# Altium schematic sheet AT89S52单片机入门与提高.SchDoc
size A3
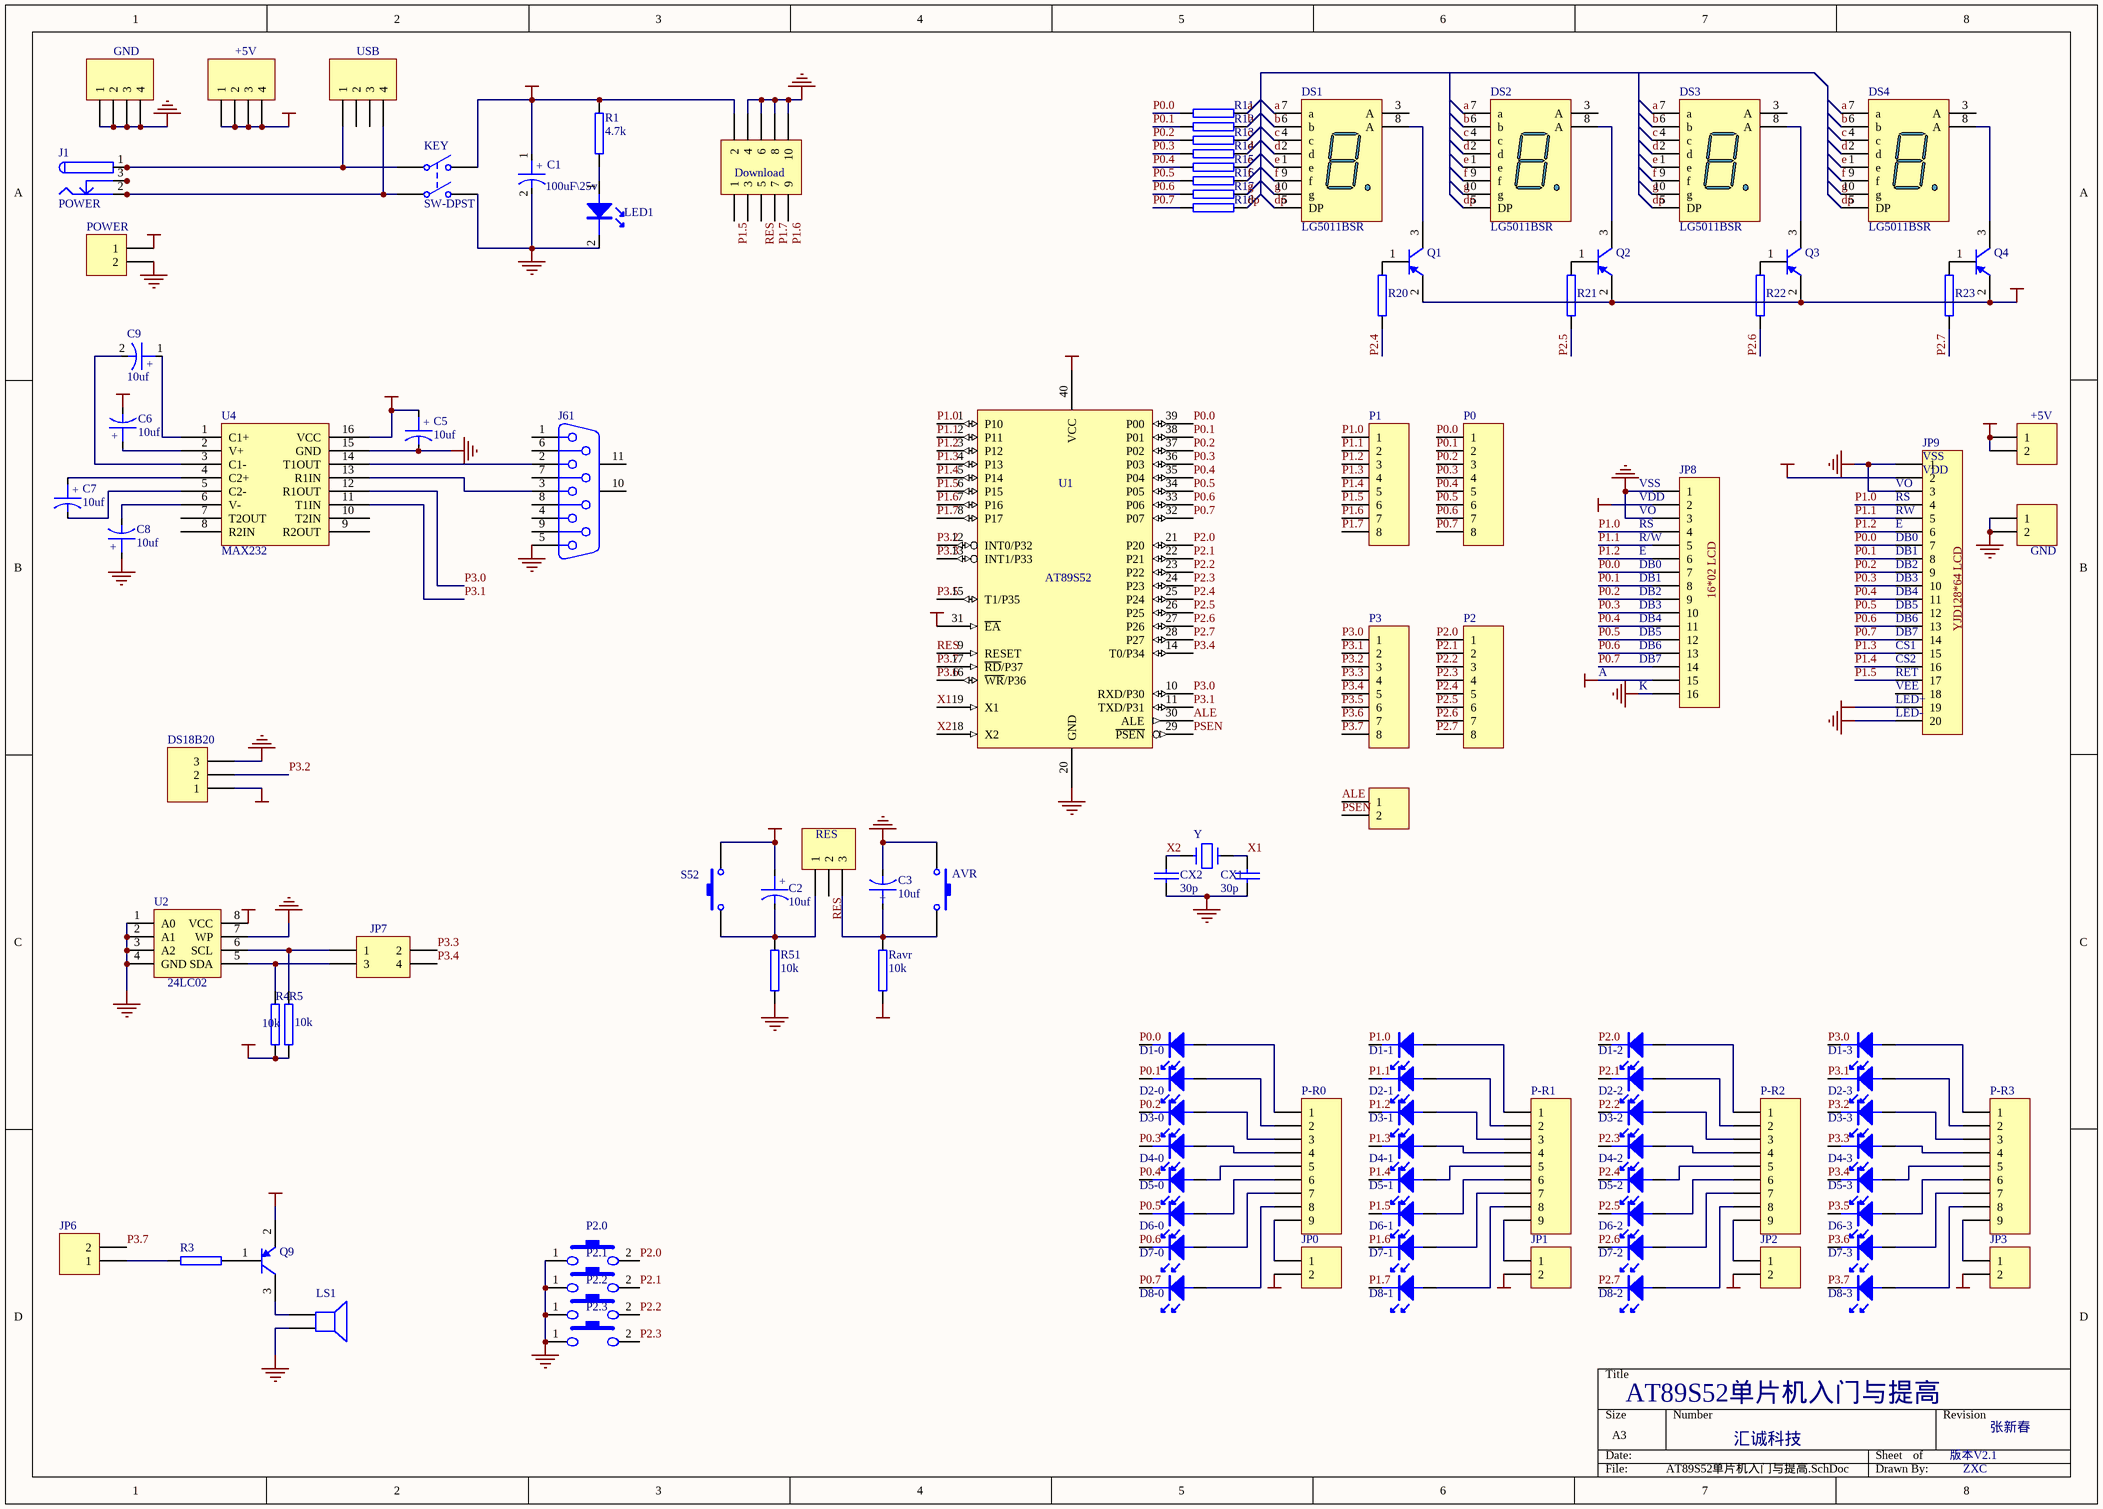
[diagram p0: AT89S52单片机入门与提高.SchDoc]

## Parts
+5V  (no value)  [HDR1X4]
+5V-1  +5V  [HDR1X2]
?  Download  [HDR-2x5]
AVR  (no value)  [an-6*6]
C1  100uF\25v  [C-DJ-6]
C2  10uf  [C-DJ-4]
C3  10uf  [C-DJ-4]
C5  10uf  [C-DJ-4]
C6  10uf  [C-DJ-4]
C7  10uf  [C-DJ-4]
C8  10uf  [C-DJ-4]
C9  10uf  [C-DJ-4]
CX1  30p  [HDR1X2]
CX2  30p  [HDR1X2]
D1-0  LED  [R2012-0805]  (value not drawn)
D1-1  LED  [R2012-0805]  (value not drawn)
D1-2  LED  [R2012-0805]  (value not drawn)
D1-3  LED  [R2012-0805]  (value not drawn)
D2-0  LED  [R2012-0805]  (value not drawn)
D2-1  LED  [R2012-0805]  (value not drawn)
D2-2  LED  [R2012-0805]  (value not drawn)
D2-3  LED  [R2012-0805]  (value not drawn)
D3-0  LED  [R2012-0805]  (value not drawn)
D3-1  LED  [R2012-0805]  (value not drawn)
D3-2  LED  [R2012-0805]  (value not drawn)
D3-3  LED  [R2012-0805]  (value not drawn)
D4-0  LED  [R2012-0805]  (value not drawn)
D4-1  LED  [R2012-0805]  (value not drawn)
D4-2  LED  [R2012-0805]  (value not drawn)
D4-3  LED  [R2012-0805]  (value not drawn)
D5-0  LED  [R2012-0805]  (value not drawn)
D5-1  LED  [R2012-0805]  (value not drawn)
D5-2  LED  [R2012-0805]  (value not drawn)
D5-3  LED  [R2012-0805]  (value not drawn)
D6-0  LED  [R2012-0805]  (value not drawn)
D6-1  LED  [R2012-0805]  (value not drawn)
D6-2  LED  [R2012-0805]  (value not drawn)
D6-3  LED  [R2012-0805]  (value not drawn)
D7-0  LED  [R2012-0805]  (value not drawn)
D7-1  LED  [R2012-0805]  (value not drawn)
D7-2  LED  [R2012-0805]  (value not drawn)
D7-3  LED  [R2012-0805]  (value not drawn)
D8-0  LED  [R2012-0805]  (value not drawn)
D8-1  LED  [R2012-0805]  (value not drawn)
D8-2  LED  [R2012-0805]  (value not drawn)
D8-3  LED  [R2012-0805]  (value not drawn)
DS1  LG5011BSR  [LED-BSR]
DS2  LG5011BSR  [LED-BSR]
DS3  LG5011BSR  [LED-BSR]
DS4  LG5011BSR  [LED-BSR]
DS18B20  (no value)  [HDR1X3]
GND  (no value)  [HDR1X4]
GND-1  GND  [HDR1X2]
J1  POWER  [KLD-dy]
J61  D Connector 9  [DSUB1.385-2H9]  (value not drawn)
JP0  (no value)  [HDR1X2]
JP1  (no value)  [HDR1X2]
JP2  (no value)  [HDR1X2]
JP3  (no value)  [HDR1X2]
JP5  (no value)  [HDR1X2]
JP6  (no value)  [HDR1X2]
JP7  (no value)  [HDR2X2]
JP8  Header 16  [HDR1X16]  (value not drawn)
JP9  (no value)  [HDR1X20]
KEY  SW-DPST  [DPDT-6]
LED1  LED  [LED]  (value not drawn)
LS1  (no value)  [LS1PF]
P0  (no value)  [HDR1X8]
P1  (no value)  [HDR1X8]
P2  (no value)  [HDR1X8]
P2.0  key1  [an-6*6]  (value not drawn)
P2.1  key2  [an-6*6]  (value not drawn)
P2.2  key3  [an-6*6]  (value not drawn)
P2.3  key4  [an-6*6]  (value not drawn)
P3  (no value)  [HDR1X8]
P-R0  (no value)  [HDR1X9]
P-R1  (no value)  [HDR1X9]
P-R2  (no value)  [HDR1X9]
P-R3  (no value)  [HDR1X9]
POWER  (no value)  [JK128]
Q1  2N3906  [SO-G3]  (value not drawn)
Q2  2N3906  [SO-G3]  (value not drawn)
Q3  2N3906  [SO-G3]  (value not drawn)
Q4  2N3906  [SO-G3]  (value not drawn)
Q9  2N3906  [SO-G3]  (value not drawn)
R1  4.7k  [R2012-0805]
R3  (no value)  [R2012-0805]
R4  10k  [R2012-0805]
R5  10k  [R2012-0805]
R11  470  [R2012-0805]  (value not drawn)
R12  470  [R2012-0805]  (value not drawn)
R13  470  [R2012-0805]  (value not drawn)
R14  470  [R2012-0805]  (value not drawn)
R15  470  [R2012-0805]  (value not drawn)
R16  470  [R2012-0805]  (value not drawn)
R17  470  [R2012-0805]  (value not drawn)
R18  470  [R2012-0805]  (value not drawn)
R20  470  [R2012-0805]  (value not drawn)
R21  470  [R2012-0805]  (value not drawn)
R22  470  [R2012-0805]  (value not drawn)
R23  470  [R2012-0805]  (value not drawn)
R51  10k  [R2012-0805]
Ravr  10k  [R2012-0805]
RES  (no value)  [HDR1X3]
S52  (no value)  [an-6*6]
U1  AT89S52  [AT89S52Pid]
U2  24LC02  [DIP8]
U4  MAX232  [DIP16]
USB  (no value)  [USB-5V]
Y  Y  [11.0592M]

## Nets
GND: ?.4 ?.6 ?.8 ?.10 AVR.2 C1.2 C3.2 C5.2 C8.1 CX1.2 CX2.2 DS18B20.3 GND.1 GND.2 GND.3 GND.4 GND-1.1 GND-1.2 J61.5 JP8.1 JP8.3 JP8.16 JP9.1 JP9.3 JP9.20 KEY.4(NO2) LED1.2(K) LS1.2 P2.0.1 P2.1.1 P2.2.1 P2.3.1 POWER.2 R51.2 U1.20(GND) U2.1(A0) U2.2(A1) U2.3(A2) U2.4(GND) U2.7(WP) U4.15(GND)
VCC: +5V.1 +5V.2 +5V.3 +5V.4 +5V-1.1 +5V-1.2 ?.2 C1.1 C2.1 C5.1 C6.2 DS18B20.1 JP0.2 JP1.2 JP2.2 JP3.2 JP8.2 JP8.15 JP9.2 JP9.19 KEY.2(NO1) POWER.1 Q1.2(E) Q2.2(E) Q3.2(E) Q4.2(E) Q9.2(E) R1.1 R4.2 R5.2 Ravr.2 S52.2 U1.31(~{EA}) U1.40(VCC) U2.8(VCC) U4.16(VCC)
a: DS1.7(a) DS2.7(a) DS3.7(a) DS4.7(a) R11.2
ALE: JP5.1 U1.30(ALE)
b: DS1.6(b) DS2.6(b) DS3.6(b) DS4.6(b) R12.2
c: DS1.4(c) DS2.4(c) DS3.4(c) DS4.4(c) R13.2
d: DS1.2(d) DS2.2(d) DS3.2(d) DS4.2(d) R14.2
dp: DS1.5(DP) DS2.5(DP) DS3.5(DP) DS4.5(DP) R18.2
e: DS1.1(e) DS2.1(e) DS3.1(e) DS4.1(e) R15.2
f: DS1.9(f) DS2.9(f) DS3.9(f) DS4.9(f) R16.2
g: DS1.10(g) DS2.10(g) DS3.10(g) DS4.10(g) R17.2
P0.0: D1-0.2(K) JP8.7 JP9.7 P0.1 R11.1 U1.39(P00)
P0.1: D2-0.2(K) JP8.8 JP9.8 P0.2 R12.1 U1.38(P01)
P0.2: D3-0.2(K) JP8.9 JP9.9 P0.3 R13.1 U1.37(P02)
P0.3: D4-0.2(K) JP8.10 JP9.10 P0.4 R14.1 U1.36(P03)
P0.4: D5-0.2(K) JP8.11 JP9.11 P0.5 R15.1 U1.35(P04)
P0.5: D6-0.2(K) JP8.12 JP9.12 P0.6 R16.1 U1.34(P05)
P0.6: D7-0.2(K) JP8.13 JP9.13 P0.7 R17.1 U1.33(P06)
P0.7: D8-0.2(K) JP8.14 JP9.14 P0.8 R18.1 U1.32(P07)
P1.0: D1-1.2(K) JP8.4 JP9.4 P1.1 U1.1(P10)
P1.1: D2-1.2(K) JP8.5 JP9.5 P1.2 U1.2(P11)
P1.2: D3-1.2(K) JP8.6 JP9.6 P1.3 U1.3(P12)
P1.3: D4-1.2(K) JP9.15 P1.4 U1.4(P13)
P1.4: D5-1.2(K) JP9.16 P1.5 U1.5(P14)
P1.5: ?.1 D6-1.2(K) JP9.17 P1.6 U1.6(P15)
P1.6: ?.9 D7-1.2(K) P1.7 U1.7(P16)
P1.7: ?.7 D8-1.2(K) P1.8 U1.8(P17)
P2.0: D1-2.2(K) P2.1 P2.0.2 U1.21(P20)
P2.1: D2-2.2(K) P2.2 P2.1.2 U1.22(P21)
P2.2: D3-2.2(K) P2.3 P2.2.2 U1.23(P22)
P2.3: D4-2.2(K) P2.4 P2.3.2 U1.24(P23)
P2.4: D5-2.2(K) P2.5 R20.1 U1.25(P24)
P2.5: D6-2.2(K) P2.6 R21.1 U1.26(P25)
P2.6: D7-2.2(K) P2.7 R22.1 U1.27(P26)
P2.7: D8-2.2(K) P2.8 R23.1 U1.28(P27)
P3.0: D1-3.2(K) P3.1 U1.10(RXD/P30) U4.12(R1OUT)
P3.1: D2-3.2(K) P3.2 U1.11(TXD/P31) U4.11(T1IN)
P3.2: D3-3.2(K) DS18B20.2 P3.3 U1.12(INT0/P32)
P3.3: D4-3.2(K) JP7.2 P3.4 U1.13(INT1/P33)
P3.4: D5-3.2(K) JP7.4 P3.5 U1.14(T0/P34)
P3.5: D6-3.2(K) P3.6 U1.15(T1/P35)
P3.6: D7-3.2(K) P3.7 U1.16(~{WR}/P36)
P3.7: D8-3.2(K) JP6.2 P3.8 U1.17(~{RD}/P37)
PSEN: JP5.2 U1.29(~{PSEN})
RES: ?.5 RES.2 U1.9(RESET)
X1: CX1.1 U1.19(X1) Y.1
X2: CX2.1 U1.18(X2) Y.2
NetAVR_1: AVR.1 C3.1 Ravr.1 RES.3
NetC2_2: C2.2 R51.1 RES.1 S52.1
NetC6_1: C6.1 U4.2(V+)
NetC7_1: C7.1 U4.4(C2+)
NetC7_2: C7.2 U4.5(C2-)
NetC8_2: C8.2 U4.6(V-)
NetC9_1: C9.1 U4.1(C1+)
NetC9_2: C9.2 U4.3(C1-)
NetD1-0_1: D1-0.1(A) P-R0.1
NetD1-1_1: D1-1.1(A) P-R1.1
NetD1-2_1: D1-2.1(A) P-R2.1
NetD1-3_1: D1-3.1(A) P-R3.1
NetD2-0_1: D2-0.1(A) P-R0.2
NetD2-1_1: D2-1.1(A) P-R1.2
NetD2-2_1: D2-2.1(A) P-R2.2
NetD2-3_1: D2-3.1(A) P-R3.2
NetD3-0_1: D3-0.1(A) P-R0.3
NetD3-1_1: D3-1.1(A) P-R1.3
NetD3-2_1: D3-2.1(A) P-R2.3
NetD3-3_1: D3-3.1(A) P-R3.3
NetD4-0_1: D4-0.1(A) P-R0.4
NetD4-1_1: D4-1.1(A) P-R1.4
NetD4-2_1: D4-2.1(A) P-R2.4
NetD4-3_1: D4-3.1(A) P-R3.4
NetD5-0_1: D5-0.1(A) P-R0.5
NetD5-1_1: D5-1.1(A) P-R1.5
NetD5-2_1: D5-2.1(A) P-R2.5
NetD5-3_1: D5-3.1(A) P-R3.5
NetD6-0_1: D6-0.1(A) P-R0.6
NetD6-1_1: D6-1.1(A) P-R1.6
NetD6-2_1: D6-2.1(A) P-R2.6
NetD6-3_1: D6-3.1(A) P-R3.6
NetD7-0_1: D7-0.1(A) P-R0.7
NetD7-1_1: D7-1.1(A) P-R1.7
NetD7-2_1: D7-2.1(A) P-R2.7
NetD7-3_1: D7-3.1(A) P-R3.7
NetD8-0_1: D8-0.1(A) P-R0.8
NetD8-1_1: D8-1.1(A) P-R1.8
NetD8-2_1: D8-2.1(A) P-R2.8
NetD8-3_1: D8-3.1(A) P-R3.8
NetDS1_8: DS1.8(A) Q1.3(C)
NetDS2_8: DS2.8(A) Q2.3(C)
NetDS3_8: DS3.8(A) Q3.3(C)
NetDS4_8: DS4.8(A) Q4.3(C)
NetJ1_1: J1.1 J1.1A J1.1B KEY.1(COMMON1) USB.1
NetJ1_2: J1.2 J1.2A J1.2B KEY.3(COMMON2) USB.4
NetJ1_3: J1.3 J1.3A J1.3B
NetJ61_2: J61.2 U4.14(T1OUT)
NetJ61_3: J61.3 U4.13(R1IN)
NetJP0_1: JP0.1 P-R0.9
NetJP1_1: JP1.1 P-R1.9
NetJP2_1: JP2.1 P-R2.9
NetJP3_1: JP3.1 P-R3.9
NetJP6_1: JP6.1 R3.1
NetJP7_1: JP7.1 R5.1 U2.6(SCL)
NetJP7_3: JP7.3 R4.1 U2.5(SDA)
NetLED1_1: LED1.1(A) R1.2
NetLS1_1: LS1.1 Q9.3(C)
NetQ1_1: Q1.1(B) R20.2
NetQ2_1: Q2.1(B) R21.2
NetQ3_1: Q3.1(B) R22.2
NetQ4_1: Q4.1(B) R23.2
NetQ9_1: Q9.1(B) R3.2

Not connected (* = marked no-connect by the designer): ? 3; DS1 3(A); DS2 3(A); DS3 3(A); DS4 3(A); J61 1 4 6 7 8 9 10(MH1) 11(MH2); JP9 18; U4 7(T2OUT) 8(R2IN) 9(R2OUT) 10(T2IN); USB 2 3

## Notes on the sheet
- (near JP8) VSS
- (near JP8) VDD
- (near JP8) VO
- (near JP9) VO
- (near JP9) RS
- (near JP9) RW
- (near JP9) VSS
- (near JP9) VDD
- (near JP8) RS
- (near JP8) R/W
- (near JP8) E
- (near JP8) DB0
- (near JP8) DB1
- (near JP9) E
- (near JP9) DB0
- (near JP9) DB1
- (near JP9) DB2
- (near JP9) DB3
- (near JP8) DB2
- (near JP8) DB3
- (near JP8) DB4
- (near JP8) DB5
- (near JP8) DB6
- (near JP9) DB4
- (near JP9) DB5
- (near JP9) DB6
- (near JP9) DB7
- (near JP9) CS1
- A
- (near JP8) DB7
- (near JP8) K
- (near JP9) CS2
- (near JP9) VEE
- (near JP9) RET
- (near JP9) LED+
- (near JP9) LED-
- AT89S52单片机入门与提高
- 汇诚科技
- 版本V2.1
- 张新春
- ZXC
- Labels drawn without touching a wire or pin: 16*02 LCD, YJD128*64 LCD
- (in symbol CAPACITOR POL) +

## Library data of the parts
+5V GND USB = Header 4: Header, 4-Pin; Revision: 17-Jul-2002: Re-released for DXP Platform.; Publisher: Altium Limited
+5V-1 GND-1 JP0-JP3 JP5 JP6 POWER = Header 2: Header, 2-Pin; LatestRevisionDate: 17-Jul-2002; LatestRevisionNote: Re-released for DXP Platform.; Publisher: Altium Limited
? = Header 5X2: Header, 5-Pin, Dual row; Revision: 17-Jul-2002: Re-released for DXP Platform.; Publisher: Altium Limited
AVR S52 = SW-PB: Switch; Published: 24-Mar-1999; LatestRevisionDate: 17-Jul-2002; LatestRevisionNote: Re-released for DXP Platform.; Publisher: Altium Limited
C1-C3 C5-C9 = CAPACITOR POL: Capacitor
CX1 CX2 = CAP: Capacitor
DS1-DS4 = Dpy Blue-CA: 14.2 mm General Purpose Blue 7-Segment Display: CA, RH DP, Gray Surface; MinimumIntensity: 2020 ucd; Note: IF = 10 mA; Published: 8-Jun-2000; LatestRevisionDate: 17-Dec-2003; LatestRevisionNote: Schematic revised, PCB Footprint replaced.; DatasheetDocument: 24-Sep-2002; PackageDocument: 24-Sep-2002; PackageReference: H; Publisher: Altium Limited; Colour: Blue
DS18B20 RES = Header 3: Header, 3-Pin; LatestRevisionDate: 17-Jul-2002; LatestRevisionNote: Re-released for DXP Platform.; Publisher: Altium Limited
J1 = PWR2.5: Low Voltage Power Supply Connector; Published: 17-Dec-2003; DatasheetDocument: 09-May-2002; Publisher: Altium Limited
J61 = D Connector 9: Receptacle Assembly, 9 Position, Right Angle; Package Information: Latest Revision: O; Positions: 9; Published: 15-Jun-2001; Revision: 17-Jul-2002: Re-released for DXP Platform.; Datasheet: (1-Sep-1999); Package Reference: 788750; Publisher: Altium Limited; Orientation: Right Angle; Gender: Receptacle
JP7 = Header 2X2: Header, 2-Pin, Dual row; LatestRevisionDate: 17-Jul-2002; LatestRevisionNote: Re-released for DXP Platform.; Publisher: Altium Limited
JP8 = Header 16: Header, 16-Pin; Revision: 17-Jul-2002: Re-released for DXP Platform.; Publisher: Altium Limited
JP9 = Header 20: Header, 20-Pin; Revision: 17-Jul-2002: Re-released for DXP Platform.; Publisher: Altium Limited
KEY = SW-DPST: Double-Pole, Single-Throw Switch; Published: 24-Mar-1999; Revision: July-2002: Re-released for DXP Platform.; Publisher: Altium Limited
LS1 = Speaker: Loudspeaker; Published: 24-Mar-1999; Revision: July-2002: Re-released for DXP Platform.; Publisher: Altium Limited
P0-P3 = MHDR1X8: Header, 8-Pin; LatestRevisionDate: 17-Jul-2002; LatestRevisionNote: Re-released for DXP Platform.; Publisher: Altium Limited
P2.0-P2.3 = key
P-R0-P-R3 = MHDR1X9: Header, 9-Pin; LatestRevisionDate: 17-Jul-2002; LatestRevisionNote: Re-released for DXP Platform.; Publisher: Altium Limited
Q1-Q4 Q9 = 2N3906: PNP General Purpose Amplifier; Revision 1: 11-Jul-2000: SIM Model Added.; Revision 2: 17-Jul-2002: Re-released for DXP Platform.; Revision 3: 15-Jan-2003: PCB Footprint 'BCY-W3/D4.7' replaced; Code - JEDEC: TO-92A; Published: 8-Jun-2000; Datasheet: Latest Revision: 1997; Package Reference: TO-92A; Publisher: Altium Limited
R1 R3-R5 R11-R18 R20-R23 R51 Ravr = RES2
U1 = 8051
Y = CRYSTAL